# Altium schematic sheet VIDEO_OSCILLATOR.SchDoc: Video Oscillator
size A4; Organization: Altium Limited.; Address1: Level 3, 12a Rodborough Rd; Address2: Frenchs Forest 2086; Address3: NSW; Address4: AUSTRALIA; SheetNumber: 1; SheetTotal: 100
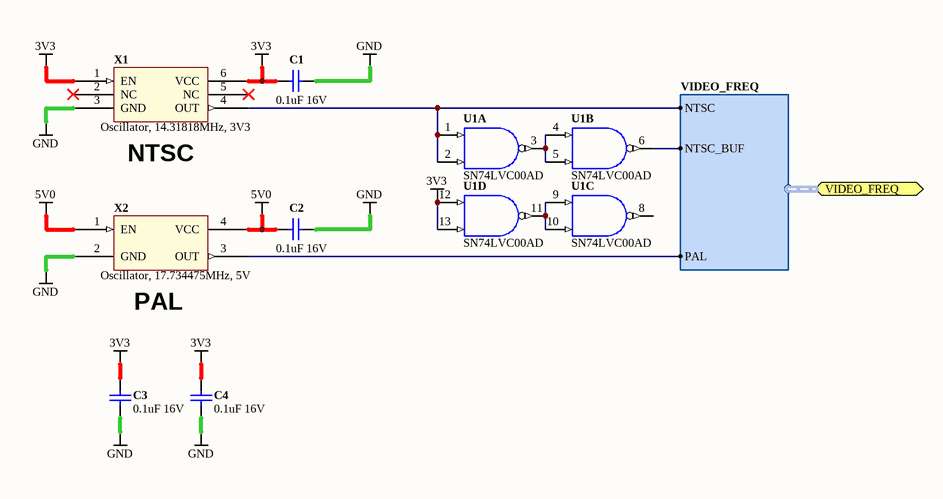
[diagram p0: VIDEO_OSCILLATOR.SchDoc]

## Parts
C1  0.1uF 16V  [CAPC1005-STAR]
C2  0.1uF 16V  [CAPC1005-STAR]
C3  0.1uF 16V  [CAPC1005-STAR]
C4  0.1uF 16V  [CAPC1005-STAR]
U1  SN74LVC00AD  [SOIC127P600-14]  (parts A,B,C,D of 4)
X1  Oscillator, 14.31818MHz, 3V3  [OSCILLATOR-5x7-FOX-XPRESS0]
X2  Oscillator, 17.734475MHz, 5V  [OSCILLATOR-8x10-CMX309]

## Ports
VIDEO_FREQ (harness VIDEO_FREQ)

## Harnesses
VIDEO_FREQ: NTSC_BUF, NTSC, PAL

## Nets
3V3: C1.1 C3.1 C4.1 U1.12(A) U1.13(B) U1.14(VDD) X1.1(EN) X1.6(VCC)
5V0: C2.1 X2.1(EN) X2.4(VCC)
GND: C1.2 C2.2 C3.2 C4.2 U1.7(GND) X1.3(GND) X2.2(GND)
NetU1_1: U1.1(A) U1.2(B) X1.4(OUT) ; port VIDEO_FREQ.NTSC
NetU1_3: U1.3(Y) U1.4(A) U1.5(B)
NetU1_6: U1.6(Y) ; port VIDEO_FREQ.NTSC_BUF
NetU1_9: U1.9(A) U1.10(B) U1.11(Y)
NetX2_3: X2.3(OUT) ; port VIDEO_FREQ.PAL

Not connected (* = marked no-connect by the designer): U1 8(Y); X1 2(NC)* 5(NC)*

## Notes on the sheet
- (near X1) NTSC
- (near X2) PAL
- Sheet Title
- Project Title
- Size:
- Date:
- A4
- Assy:
- Time:
- Revision:
- Sheet
- of
- File:

## Library data of the parts
C1-C4 = D-101-0080: Capacitor, Ceramic, 0.1uF 10% 16V 0402 (1005) X7R; Polarity: Non-Polarized; Capacitance: 0.1 uF; Category: Capacitor; Dielectric: X7R; Mounting Technology: Surface Mount; Rated Voltage: 16 V; Status: Production; Technology: Ceramic; Tolerance: 10 %
U1 = D-205-0002: SN74LVC00AD, Quad 2-Input Positive-Nand Gates, 1.65-3.6V, 5V Tolerant Inputs; Status: Production; Category: IC-Logic
X1 = D-103-0015: Crystal Oscillator, 14.31818MHz, 3V3, 5x7mm, 50ppm, Fox, FXO-HC735R-14.31818; Frequency Tolerance: ppm; Load Capacitance: 15 pF; Nominal Operational Voltage: 3.3 V; Frequency Stability: 50 ppm; Mounting Technology: Surface Mount; Nominal Fequency: 14.31818 MHz; Status: Production; Category: Crystal
X2 = D-103-0016: Crystal Oscillator, 17.734475MHz, 50ppm, 5V, 8x10mm, SMD; Frequency Tolerance: ppm; Load Capacitance: 50 pF; Frequency Stability: 50 ppm; Mounting Technology: Surface Mount; Nominal Fequency: 17.734475 MHz; Nominal Operational Voltage: 5 V; Status: Production; Category: Crystal